# Altium schematic sheet EP4CE55F23C8N_A.SchDoc
size A1 portrait; SheetNumber: 1; SheetTotal: 16
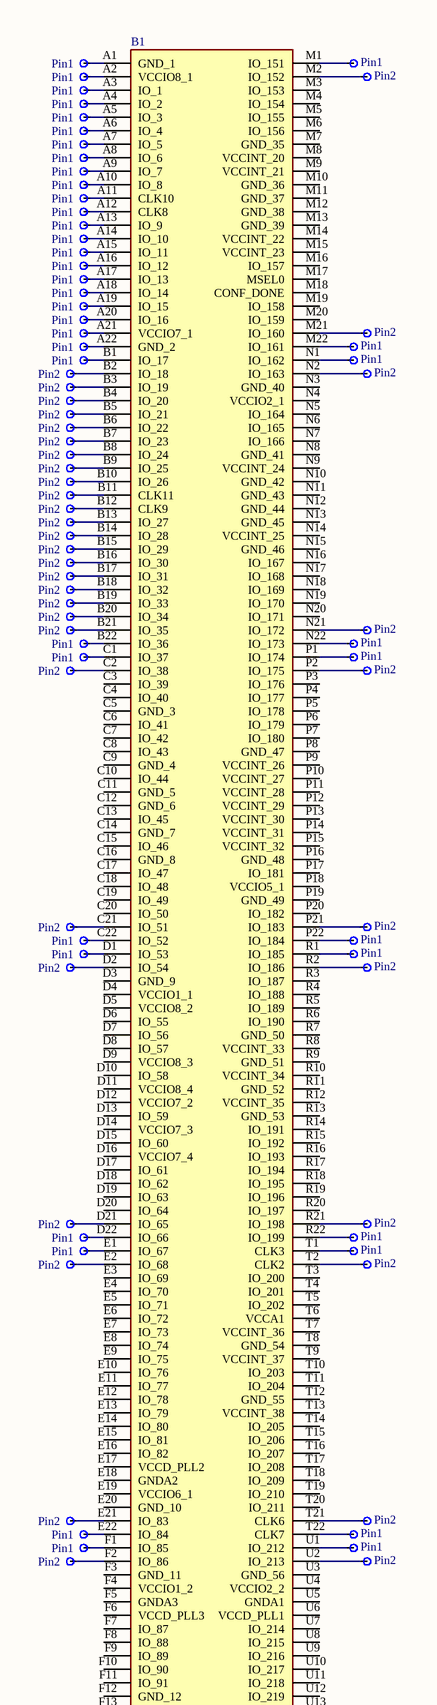
[diagram p0: EP4CE55F23C8N_A.SchDoc, top]
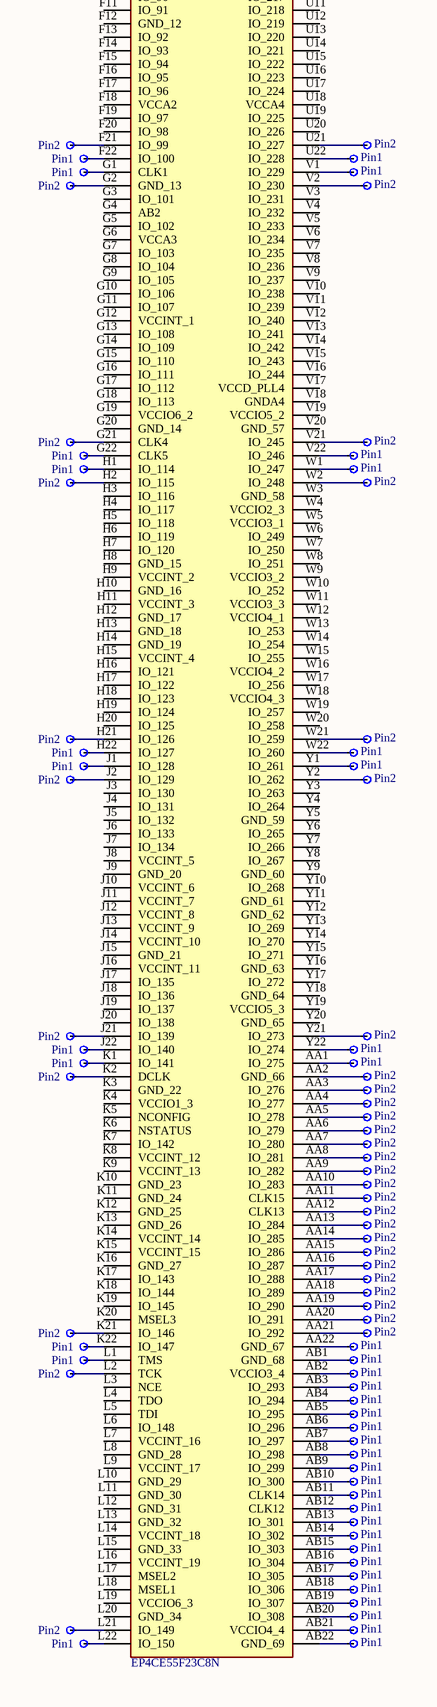
[diagram p1: EP4CE55F23C8N_A.SchDoc, bottom]

## Parts
B1  EP4CE55F23C8N  [BGA484C100P22X22_2300X2300X240]
J1  Pin1  [Pin1]
J2  Pin1  [Pin1]
J3  Pin1  [Pin1]
J4  Pin2  [Pin1]
J5  Pin1  [Pin1]
J6  Pin1  [Pin1]
J7  Pin1  [Pin1]
J8  Pin1  [Pin1]
J9  Pin1  [Pin1]
J10  Pin1  [Pin1]
J11  Pin1  [Pin1]
J12  Pin1  [Pin1]
J13  Pin1  [Pin1]
J14  Pin1  [Pin1]
J15  Pin1  [Pin1]
J16  Pin1  [Pin1]
J17  Pin1  [Pin1]
J18  Pin1  [Pin1]
J19  Pin1  [Pin1]
J20  Pin1  [Pin1]
J21  Pin1  [Pin1]
J22  Pin1  [Pin1]
J23  Pin1  [Pin1]
J24  Pin2  [Pin1]
J25  Pin1  [Pin1]
J26  Pin1  [Pin1]
J27  Pin1  [Pin1]
J28  Pin1  [Pin1]
J29  Pin2  [Pin1]
J30  Pin2  [Pin1]
J31  Pin2  [Pin1]
J32  Pin2  [Pin1]
J33  Pin2  [Pin1]
J34  Pin2  [Pin1]
J35  Pin2  [Pin1]
J36  Pin2  [Pin1]
J37  Pin2  [Pin1]
J38  Pin2  [Pin1]
J39  Pin2  [Pin1]
J40  Pin2  [Pin1]
J41  Pin2  [Pin1]
J42  Pin2  [Pin1]
J43  Pin2  [Pin1]
J44  Pin2  [Pin1]
J45  Pin2  [Pin1]
J46  Pin2  [Pin1]
J47  Pin2  [Pin1]
J48  Pin2  [Pin1]
J49  Pin2  [Pin1]
J50  Pin2  [Pin1]
J51  Pin1  [Pin1]
J52  Pin1  [Pin1]
J53  Pin1  [Pin1]
J54  Pin1  [Pin1]
J55  Pin2  [Pin1]
J56  Pin2  [Pin1]
J57  Pin2  [Pin1]
J58  Pin2  [Pin1]
J59  Pin1  [Pin1]
J60  Pin1  [Pin1]
J61  Pin1  [Pin1]
J62  Pin1  [Pin1]
J63  Pin2  [Pin1]
J64  Pin2  [Pin1]
J65  Pin2  [Pin1]
J66  Pin2  [Pin1]
J67  Pin1  [Pin1]
J68  Pin1  [Pin1]
J69  Pin1  [Pin1]
J70  Pin1  [Pin1]
J71  Pin2  [Pin1]
J72  Pin2  [Pin1]
J73  Pin2  [Pin1]
J74  Pin2  [Pin1]
J75  Pin1  [Pin1]
J76  Pin1  [Pin1]
J77  Pin1  [Pin1]
J78  Pin1  [Pin1]
J79  Pin2  [Pin1]
J80  Pin2  [Pin1]
J81  Pin2  [Pin1]
J82  Pin2  [Pin1]
J83  Pin1  [Pin1]
J84  Pin1  [Pin1]
J85  Pin1  [Pin1]
J86  Pin1  [Pin1]
J87  Pin2  [Pin1]
J88  Pin2  [Pin1]
J89  Pin2  [Pin1]
J90  Pin2  [Pin1]
J91  Pin1  [Pin1]
J92  Pin1  [Pin1]
J93  Pin1  [Pin1]
J94  Pin1  [Pin1]
J95  Pin2  [Pin1]
J96  Pin2  [Pin1]
J97  Pin2  [Pin1]
J98  Pin2  [Pin1]
J99  Pin1  [Pin1]
J100  Pin1  [Pin1]
J101  Pin1  [Pin1]
J102  Pin1  [Pin1]
J103  Pin2  [Pin1]
J104  Pin2  [Pin1]
J105  Pin2  [Pin1]
J106  Pin2  [Pin1]
J107  Pin1  [Pin1]
J108  Pin1  [Pin1]
J109  Pin1  [Pin1]
J110  Pin1  [Pin1]
J111  Pin2  [Pin1]
J112  Pin2  [Pin1]
J113  Pin2  [Pin1]
J114  Pin2  [Pin1]
J115  Pin2  [Pin1]
J116  Pin2  [Pin1]
J117  Pin2  [Pin1]
J118  Pin2  [Pin1]
J119  Pin2  [Pin1]
J120  Pin2  [Pin1]
J121  Pin2  [Pin1]
J122  Pin2  [Pin1]
J123  Pin2  [Pin1]
J124  Pin2  [Pin1]
J125  Pin2  [Pin1]
J126  Pin2  [Pin1]
J127  Pin2  [Pin1]
J128  Pin2  [Pin1]
J129  Pin2  [Pin1]
J130  Pin2  [Pin1]
J131  Pin2  [Pin1]
J132  Pin2  [Pin1]
J133  Pin1  [Pin1]
J134  Pin1  [Pin1]
J135  Pin1  [Pin1]
J136  Pin1  [Pin1]
J137  Pin2  [Pin1]
J138  Pin1  [Pin1]
J139  Pin1  [Pin1]
J140  Pin1  [Pin1]
J141  Pin1  [Pin1]
J142  Pin1  [Pin1]
J143  Pin1  [Pin1]
J144  Pin1  [Pin1]
J145  Pin1  [Pin1]
J146  Pin1  [Pin1]
J147  Pin1  [Pin1]
J148  Pin1  [Pin1]
J149  Pin1  [Pin1]
J150  Pin1  [Pin1]
J151  Pin1  [Pin1]
J152  Pin1  [Pin1]
J153  Pin1  [Pin1]
J154  Pin1  [Pin1]
J155  Pin1  [Pin1]
J156  Pin1  [Pin1]
J157  Pin2  [Pin1]
J158  Pin1  [Pin1]
J159  Pin1  [Pin1]
J160  Pin1  [Pin1]

## Nets
NetB1_A1: B1.A1(GND_1) J1.1
NetB1_A2: B1.A2(VCCIO8_1) J3.1
NetB1_A3: B1.A3(IO_1) J5.1
NetB1_A4: B1.A4(IO_2) J6.1
NetB1_A5: B1.A5(IO_3) J7.1
NetB1_A6: B1.A6(IO_4) J8.1
NetB1_A7: B1.A7(IO_5) J9.1
NetB1_A8: B1.A8(IO_6) J10.1
NetB1_A9: B1.A9(IO_7) J11.1
NetB1_A10: B1.A10(IO_8) J12.1
NetB1_A11: B1.A11(CLK10) J13.1
NetB1_A12: B1.A12(CLK8) J14.1
NetB1_A13: B1.A13(IO_9) J15.1
NetB1_A14: B1.A14(IO_10) J16.1
NetB1_A15: B1.A15(IO_11) J17.1
NetB1_A16: B1.A16(IO_12) J18.1
NetB1_A17: B1.A17(IO_13) J19.1
NetB1_A18: B1.A18(IO_14) J20.1
NetB1_A19: B1.A19(IO_15) J21.1
NetB1_A20: B1.A20(IO_16) J22.1
NetB1_A21: B1.A21(VCCIO7_1) J23.1
NetB1_A22: B1.A22(GND_2) J25.1
NetB1_AA1: B1.AA1(IO_275) J110.1
NetB1_AA2: B1.AA2(GND_66) J112.1
NetB1_AA3: B1.AA3(IO_276) J113.1
NetB1_AA4: B1.AA4(IO_277) J114.1
NetB1_AA5: B1.AA5(IO_278) J115.1
NetB1_AA6: B1.AA6(IO_279) J116.1
NetB1_AA7: B1.AA7(IO_280) J117.1
NetB1_AA8: B1.AA8(IO_281) J118.1
NetB1_AA9: B1.AA9(IO_282) J119.1
NetB1_AA10: B1.AA10(IO_283) J120.1
NetB1_AA11: B1.AA11(CLK15) J121.1
NetB1_AA12: B1.AA12(CLK13) J122.1
NetB1_AA13: B1.AA13(IO_284) J123.1
NetB1_AA14: B1.AA14(IO_285) J124.1
NetB1_AA15: B1.AA15(IO_286) J125.1
NetB1_AA16: B1.AA16(IO_287) J126.1
NetB1_AA17: B1.AA17(IO_288) J127.1
NetB1_AA18: B1.AA18(IO_289) J128.1
NetB1_AA19: B1.AA19(IO_290) J129.1
NetB1_AA20: B1.AA20(IO_291) J130.1
NetB1_AA21: B1.AA21(IO_292) J132.1
NetB1_AA22: B1.AA22(GND_67) J134.1
NetB1_AB1: B1.AB1(GND_68) J136.1
NetB1_AB2: B1.AB2(VCCIO3_4) J138.1
NetB1_AB3: B1.AB3(IO_293) J139.1
NetB1_AB4: B1.AB4(IO_294) J140.1
NetB1_AB5: B1.AB5(IO_295) J141.1
NetB1_AB6: B1.AB6(IO_296) J142.1
NetB1_AB7: B1.AB7(IO_297) J143.1
NetB1_AB8: B1.AB8(IO_298) J144.1
NetB1_AB9: B1.AB9(IO_299) J145.1
NetB1_AB10: B1.AB10(IO_300) J146.1
NetB1_AB11: B1.AB11(CLK14) J147.1
NetB1_AB12: B1.AB12(CLK12) J148.1
NetB1_AB13: B1.AB13(IO_301) J149.1
NetB1_AB14: B1.AB14(IO_302) J150.1
NetB1_AB15: B1.AB15(IO_303) J151.1
NetB1_AB16: B1.AB16(IO_304) J152.1
NetB1_AB17: B1.AB17(IO_305) J153.1
NetB1_AB18: B1.AB18(IO_306) J154.1
NetB1_AB19: B1.AB19(IO_307) J155.1
NetB1_AB20: B1.AB20(IO_308) J156.1
NetB1_AB21: B1.AB21(VCCIO4_4) J158.1
NetB1_AB22: B1.AB22(GND_69) J160.1
NetB1_B1: B1.B1(IO_17) J27.1
NetB1_B2: B1.B2(IO_18) J29.1
NetB1_B3: B1.B3(IO_19) J31.1
NetB1_B4: B1.B4(IO_20) J32.1
NetB1_B5: B1.B5(IO_21) J33.1
NetB1_B6: B1.B6(IO_22) J34.1
NetB1_B7: B1.B7(IO_23) J35.1
NetB1_B8: B1.B8(IO_24) J36.1
NetB1_B9: B1.B9(IO_25) J37.1
NetB1_B10: B1.B10(IO_26) J38.1
NetB1_B11: B1.B11(CLK11) J39.1
NetB1_B12: B1.B12(CLK9) J40.1
NetB1_B13: B1.B13(IO_27) J41.1
NetB1_B14: B1.B14(IO_28) J42.1
NetB1_B15: B1.B15(IO_29) J43.1
NetB1_B16: B1.B16(IO_30) J44.1
NetB1_B17: B1.B17(IO_31) J45.1
NetB1_B18: B1.B18(IO_32) J46.1
NetB1_B19: B1.B19(IO_33) J47.1
NetB1_B20: B1.B20(IO_34) J48.1
NetB1_B21: B1.B21(IO_35) J49.1
NetB1_B22: B1.B22(IO_36) J51.1
NetB1_C1: B1.C1(IO_37) J53.1
NetB1_C2: B1.C2(IO_38) J55.1
NetB1_C21: B1.C21(IO_51) J57.1
NetB1_C22: B1.C22(IO_52) J59.1
NetB1_D1: B1.D1(IO_53) J61.1
NetB1_D2: B1.D2(IO_54) J63.1
NetB1_D21: B1.D21(IO_65) J65.1
NetB1_D22: B1.D22(IO_66) J67.1
NetB1_E1: B1.E1(IO_67) J69.1
NetB1_E2: B1.E2(IO_68) J71.1
NetB1_E21: B1.E21(IO_83) J73.1
NetB1_E22: B1.E22(IO_84) J75.1
NetB1_F1: B1.F1(IO_85) J77.1
NetB1_F2: B1.F2(IO_86) J79.1
NetB1_F21: B1.F21(IO_99) J81.1
NetB1_F22: B1.F22(IO_100) J83.1
NetB1_G1: B1.G1(CLK1) J85.1
NetB1_G2: B1.G2(GND_13) J87.1
NetB1_G21: B1.G21(CLK4) J89.1
NetB1_G22: B1.G22(CLK5) J91.1
NetB1_H1: B1.H1(IO_114) J93.1
NetB1_H2: B1.H2(IO_115) J95.1
NetB1_H21: B1.H21(IO_126) J97.1
NetB1_H22: B1.H22(IO_127) J99.1
NetB1_J1: B1.J1(IO_128) J101.1
NetB1_J2: B1.J2(IO_129) J103.1
NetB1_J21: B1.J21(IO_139) J105.1
NetB1_J22: B1.J22(IO_140) J107.1
NetB1_K1: B1.K1(IO_141) J109.1
NetB1_K2: B1.K2(DCLK) J111.1
NetB1_K21: B1.K21(IO_146) J131.1
NetB1_K22: B1.K22(IO_147) J133.1
NetB1_L1: B1.L1(TMS) J135.1
NetB1_L2: B1.L2(TCK) J137.1
NetB1_L21: B1.L21(IO_149) J157.1
NetB1_L22: B1.L22(IO_150) J159.1
NetB1_M1: B1.M1(IO_151) J2.1
NetB1_M2: B1.M2(IO_152) J4.1
NetB1_M21: B1.M21(IO_160) J24.1
NetB1_M22: B1.M22(IO_161) J26.1
NetB1_N1: B1.N1(IO_162) J28.1
NetB1_N2: B1.N2(IO_163) J30.1
NetB1_N21: B1.N21(IO_172) J50.1
NetB1_N22: B1.N22(IO_173) J52.1
NetB1_P1: B1.P1(IO_174) J54.1
NetB1_P2: B1.P2(IO_175) J56.1
NetB1_P21: B1.P21(IO_183) J58.1
NetB1_P22: B1.P22(IO_184) J60.1
NetB1_R1: B1.R1(IO_185) J62.1
NetB1_R2: B1.R2(IO_186) J64.1
NetB1_R21: B1.R21(IO_198) J66.1
NetB1_R22: B1.R22(IO_199) J68.1
NetB1_T1: B1.T1(CLK3) J70.1
NetB1_T2: B1.T2(CLK2) J72.1
NetB1_T21: B1.T21(CLK6) J74.1
NetB1_T22: B1.T22(CLK7) J76.1
NetB1_U1: B1.U1(IO_212) J78.1
NetB1_U2: B1.U2(IO_213) J80.1
NetB1_U21: B1.U21(IO_227) J82.1
NetB1_U22: B1.U22(IO_228) J84.1
NetB1_V1: B1.V1(IO_229) J86.1
NetB1_V2: B1.V2(IO_230) J88.1
NetB1_V21: B1.V21(IO_245) J90.1
NetB1_V22: B1.V22(IO_246) J92.1
NetB1_W1: B1.W1(IO_247) J94.1
NetB1_W2: B1.W2(IO_248) J96.1
NetB1_W21: B1.W21(IO_259) J98.1
NetB1_W22: B1.W22(IO_260) J100.1
NetB1_Y1: B1.Y1(IO_261) J102.1
NetB1_Y2: B1.Y2(IO_262) J104.1
NetB1_Y21: B1.Y21(IO_273) J106.1
NetB1_Y22: B1.Y22(IO_274) J108.1

Not connected (* = marked no-connect by the designer): B1 C3(IO_39) C4(IO_40) C5(GND_3) C6(IO_41) C7(IO_42) C8(IO_43) C9(GND_4) C10(IO_44) C11(GND_5) C12(GND_6) C13(IO_45) C14(GND_7) C15(IO_46) C16(GND_8) C17(IO_47) C18(IO_48) C19(IO_49) C20(IO_50) D3(GND_9) D4(VCCIO1_1) D5(VCCIO8_2) D6(IO_55) D7(IO_56) D8(IO_57) D9(VCCIO8_3) D10(IO_58) D11(VCCIO8_4) D12(VCCIO7_2) D13(IO_59) D14(VCCIO7_3) D15(IO_60) D16(VCCIO7_4) D17(IO_61) D18(IO_62) D19(IO_63) D20(IO_64) E3(IO_69) E4(IO_70) E5(IO_71) E6(IO_72) E7(IO_73) E8(IO_74) E9(IO_75) E10(IO_76) E11(IO_77) E12(IO_78) E13(IO_79) E14(IO_80) E15(IO_81) E16(IO_82) E17(VCCD_PLL2) E18(GNDA2) E19(VCCIO6_1) E20(GND_10) F3(GND_11) F4(VCCIO1_2) F5(GNDA3) F6(VCCD_PLL3) F7(IO_87) F8(IO_88) F9(IO_89) F10(IO_90) F11(IO_91) F12(GND_12) F13(IO_92) F14(IO_93) F15(IO_94) F16(IO_95) F17(IO_96) F18(VCCA2) F19(IO_97) F20(IO_98) G3(IO_101) G4(AB2) G5(IO_102) G6(VCCA3) G7(IO_103) G8(IO_104) G9(IO_105) G10(IO_106) G11(IO_107) G12(VCCINT_1) G13(IO_108) G14(IO_109) G15(IO_110) G16(IO_111) G17(IO_112) G18(IO_113) G19(VCCIO6_2) G20(GND_14) H3(IO_116) H4(IO_117) H5(IO_118) H6(IO_119) H7(IO_120) H8(GND_15) H9(VCCINT_2) H10(GND_16) H11(VCCINT_3) H12(GND_17) H13(GND_18) H14(GND_19) H15(VCCINT_4) H16(IO_121) H17(IO_122) H18(IO_123) H19(IO_124) H20(IO_125) J3(IO_130) J4(IO_131) J5(IO_132) J6(IO_133) J7(IO_134) J8(VCCINT_5) J9(GND_20) J10(VCCINT_6) J11(VCCINT_7) J12(VCCINT_8) J13(VCCINT_9) J14(VCCINT_10) J15(GND_21) J16(VCCINT_11) J17(IO_135) J18(IO_136) J19(IO_137) J20(IO_138) K3(GND_22) K4(VCCIO1_3) K5(NCONFIG) K6(NSTATUS) K7(IO_142) K8(VCCINT_12) K9(VCCINT_13) K10(GND_23) K11(GND_24) K12(GND_25) K13(GND_26) K14(VCCINT_14) K15(VCCINT_15) K16(GND_27) K17(IO_143) K18(IO_144) K19(IO_145) K20(MSEL3) L3(NCE) L4(TDO) L5(TDI) L6(IO_148) L7(VCCINT_16) L8(GND_28) L9(VCCINT_17) L10(GND_29) L11(GND_30) L12(GND_31) L13(GND_32) L14(VCCINT_18) L15(GND_33) L16(VCCINT_19) L17(MSEL2) L18(MSEL1) L19(VCCIO6_3) L20(GND_34) M3(IO_153) M4(IO_154) M5(IO_155) M6(IO_156) M7(GND_35) M8(VCCINT_20) M9(VCCINT_21) M10(GND_36) M11(GND_37) M12(GND_38) M13(GND_39) M14(VCCINT_22) M15(VCCINT_23) M16(IO_157) M17(MSEL0) M18(CONF_DONE) M19(IO_158) M20(IO_159) N3(GND_40) N4(VCCIO2_1) N5(IO_164) N6(IO_165) N7(IO_166) N8(GND_41) N9(VCCINT_24) N10(GND_42) N11(GND_43) N12(GND_44) N13(GND_45) N14(VCCINT_25) N15(GND_46) N16(IO_167) N17(IO_168) N18(IO_169) N19(IO_170) N20(IO_171) P3(IO_176) P4(IO_177) P5(IO_178) P6(IO_179) P7(IO_180) P8(GND_47) P9(VCCINT_26) P10(VCCINT_27) P11(VCCINT_28) P12(VCCINT_29) P13(VCCINT_30) P14(VCCINT_31) P15(VCCINT_32) P16(GND_48) P17(IO_181) P18(VCCIO5_1) P19(GND_49) P20(IO_182) R3(IO_187) R4(IO_188) R5(IO_189) R6(IO_190) R7(GND_50) R8(VCCINT_33) R9(GND_51) R10(VCCINT_34) R11(GND_52) R12(VCCINT_35) R13(GND_53) R14(IO_191) R15(IO_192) R16(IO_193) R17(IO_194) R18(IO_195) R19(IO_196) R20(IO_197) T3(IO_200) T4(IO_201) T5(IO_202) T6(VCCA1) T7(VCCINT_36) T8(GND_54) T9(VCCINT_37) T10(IO_203) T11(IO_204) T12(GND_55) T13(VCCINT_38) T14(IO_205) T15(IO_206) T16(IO_207) T17(IO_208) T18(IO_209) T19(IO_210) T20(IO_211) U3(GND_56) U4(VCCIO2_2) U5(GNDA1) U6(VCCD_PLL1) U7(IO_214) U8(IO_215) U9(IO_216) U10(IO_217) U11(IO_218) U12(IO_219) U13(IO_220) U14(IO_221) U15(IO_222) U16(IO_223) U17(IO_224) U18(VCCA4) U19(IO_225) U20(IO_226) V3(IO_231) V4(IO_232) V5(IO_233) V6(IO_234) V7(IO_235) V8(IO_236) V9(IO_237) V10(IO_238) V11(IO_239) V12(IO_240) V13(IO_241) V14(IO_242) V15(IO_243) V16(IO_244) V17(VCCD_PLL4) V18(GNDA4) V19(VCCIO5_2) V20(GND_57) W3(GND_58) W4(VCCIO2_3) W5(VCCIO3_1) W6(IO_249) W7(IO_250) W8(IO_251) W9(VCCIO3_2) W10(IO_252) W11(VCCIO3_3) W12(VCCIO4_1) W13(IO_253) W14(IO_254) W15(IO_255) W16(VCCIO4_2) W17(IO_256) W18(VCCIO4_3) W19(IO_257) W20(IO_258) Y3(IO_263) Y4(IO_264) Y5(GND_59) Y6(IO_265) Y7(IO_266) Y8(IO_267) Y9(GND_60) Y10(IO_268) Y11(GND_61) Y12(GND_62) Y13(IO_269) Y14(IO_270) Y15(IO_271) Y16(GND_63) Y17(IO_272) Y18(GND_64) Y19(VCCIO5_3) Y20(GND_65)

## Library data of the parts
B1 = EP4CE55F23C8N: FPGA - Field Programmable Gate Array FPGA - Cyclone IV E 3491 LABs 324 IOs; Manufacturer_Name: Intel; Geometry.Height: 2.4mm; Manufacturer_Part_Number: EP4CE55F23C8N; Mouser Part Number: 989-EP4CE55F23C8N; Mouser Price/Stock: https://www.mouser.co.uk/ProductDetail/Altera/EP4CE55F23C8N?qs=jblrfmjbeiF3merBMihRew%3D%3D; Arrow Part Number: EP4CE55F23C8N; Arrow Price/Stock: https://www.arrow.com/en/products/ep4ce55f23c8n/alteraintel-programmable-solutions?utm_currency=USD&region=nac; Datasheet Link: https://www.intel.com/content/dam/www/programmable/us/en/pdfs/literature/packaging/04r00416-03.pdf
J4 J24 J29-J50 J55-J58 J63-J66 J71-J74 J79-J82 J87-J90 J95-J98 J103-J106 J111-J132 J137 J157 = Pin1